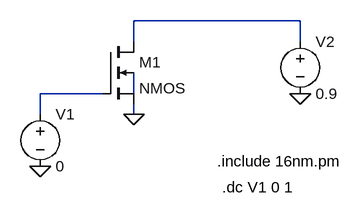
[diagram p0: schematic test.asc]
test.asc, the LTspice schematic file:
Version 4
SHEET 1 880 680
WIRE 416 112 160 112
WIRE 160 144 160 112
WIRE 416 144 416 112
WIRE 112 224 16 224
WIRE 160 224 160 192
WIRE 16 256 16 224
WIRE 160 256 160 240
FLAG 160 256 0
FLAG 16 336 0
FLAG 416 224 0
SYMBOL voltage 16 240 R0
WINDOW 123 0 0 Left 0
WINDOW 39 0 0 Left 0
SYMATTR InstName V1
SYMATTR Value 0
SYMBOL voltage 416 128 R0
WINDOW 123 0 0 Left 0
WINDOW 39 0 0 Left 0
SYMATTR InstName V2
SYMATTR Value 0.9
SYMBOL nmos4 112 144 R0
SYMATTR InstName M1
SYMATTR Value2 l=16nm w=1u
TEXT 288 328 Left 2 !.include 16nm.pm
TEXT 296 368 Left 2 !.dc V1 0 1

The netlist it stands for:
* test.asc
V1 N002 0 0
V2 N001 0 0.9
M1 N001 N002 0 N003 NMOS l=16nm w=1u
.model NMOS NMOS
.model PMOS PMOS
.lib standard.mos
.include 16nm.pm
.dc V1 0 1
.backanno
.end